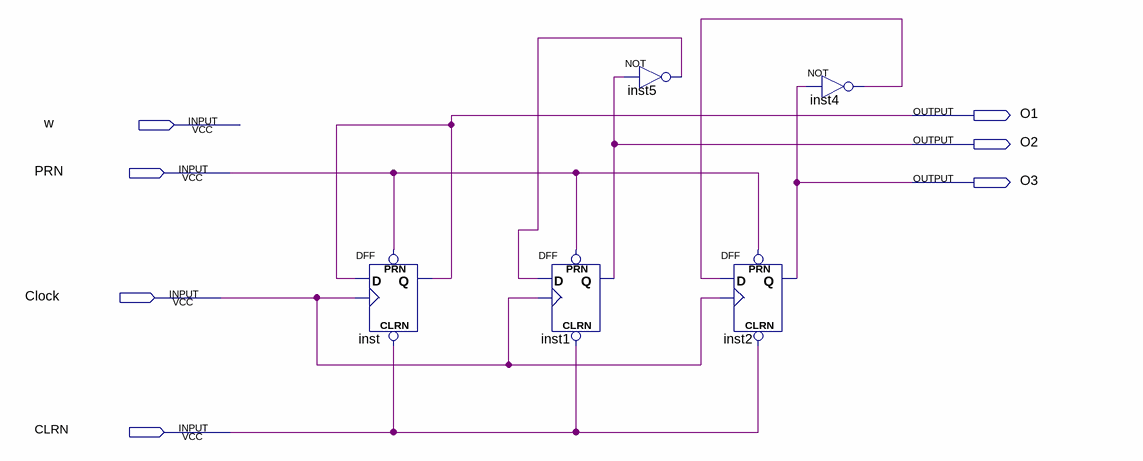
[diagram p0: schematic sheet]
// Quartus schematic lab11step1.bdf as structural Verilog: 5 symbols, 7 pins
module lab11step1 (
  input  w,
  input  PRN,
  input  Clock,
  input  CLRN,
  output O1,
  output O2,
  output O3
);

  wire inst4_out, inst5_out;

  DFF inst (.CLRN(CLRN), .CLK(Clock), .D(O1), .PRN(PRN), .Q(O1));
  DFF inst1 (.CLRN(CLRN), .CLK(Clock), .D(inst5_out), .PRN(PRN), .Q(O2));
  not inst5 (inst5_out, O2);
  DFF inst2 (.CLRN(CLRN), .CLK(Clock), .D(inst4_out), .PRN(PRN), .Q(O3));
  not inst4 (inst4_out, O3);
endmodule
